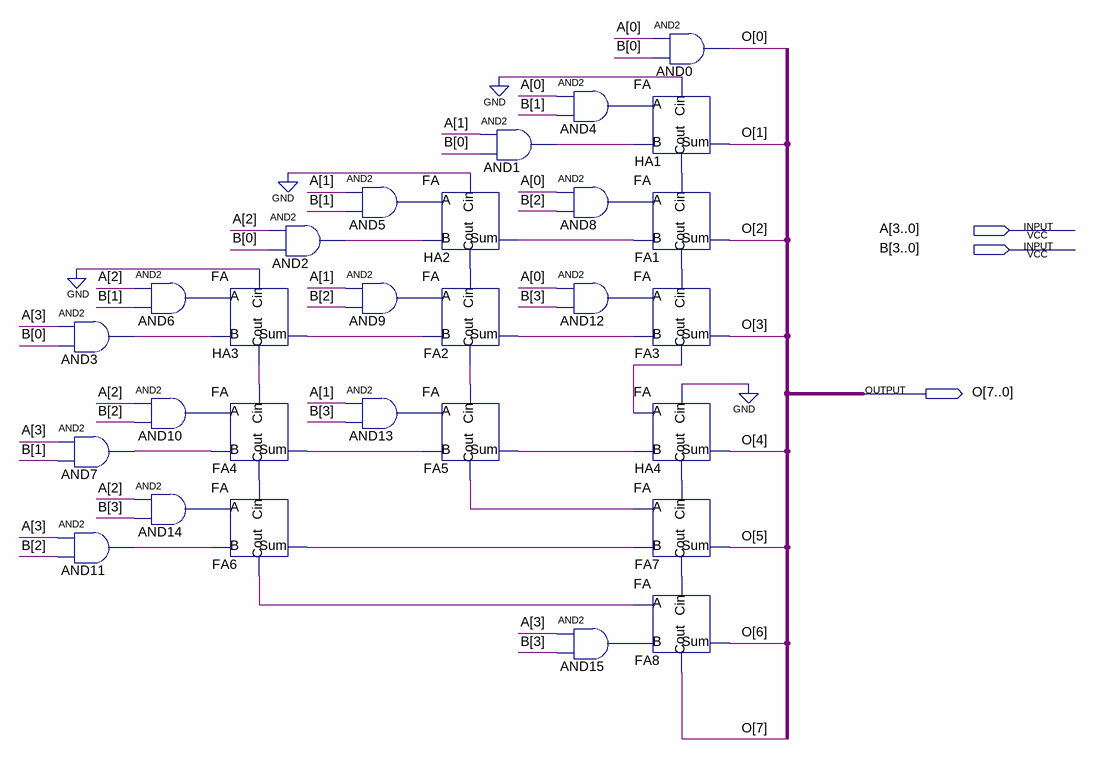
[diagram p0: schematic sheet]
// Quartus schematic Mult4.bdf as structural Verilog: 28 symbols, 3 pins
module Mult4 (
  input  [3:0] A,
  input  [3:0] B,
  output [7:0] O
);

  wire AND1_out, AND2_out, AND3_out, AND4_out, AND5_out, AND6_out, AND7_out, AND8_out, AND9_out, AND10_out,
       AND11_out, AND12_out, AND13_out, AND14_out, AND15_out, FA1_cout, FA2_cout, FA2_sum, FA3_cout,
       FA4_cout, FA4_sum, FA5_cout, FA5_sum, FA6_cout, FA6_sum, FA7_cout, HA1_cout, HA2_cout, HA2_sum,
       HA3_cout, HA3_sum, HA4_cout;

  and AND3 (AND3_out, A[3], B[0]);
  and AND7 (AND7_out, A[3], B[1]);
  and AND11 (AND11_out, A[3], B[2]);
  and AND6 (AND6_out, A[2], B[1]);
  and AND10 (AND10_out, A[2], B[2]);
  and AND14 (AND14_out, A[2], B[3]);
  FA HA3 (.A(AND6_out), .B(AND3_out), .Cin(1'b0), .Sum(HA3_sum), .Cout(HA3_cout));
  FA FA4 (.A(AND10_out), .B(AND7_out), .Cin(HA3_cout), .Sum(FA4_sum), .Cout(FA4_cout));
  FA FA6 (.A(AND14_out), .B(AND11_out), .Cin(FA4_cout), .Sum(FA6_sum), .Cout(FA6_cout));
  and AND2 (AND2_out, A[2], B[0]);
  and AND5 (AND5_out, A[1], B[1]);
  and AND9 (AND9_out, A[1], B[2]);
  and AND13 (AND13_out, A[1], B[3]);
  and AND1 (AND1_out, A[1], B[0]);
  FA HA2 (.A(AND5_out), .B(AND2_out), .Cin(1'b0), .Sum(HA2_sum), .Cout(HA2_cout));
  FA FA2 (.A(AND9_out), .B(HA3_sum), .Cin(HA2_cout), .Sum(FA2_sum), .Cout(FA2_cout));
  FA FA5 (.A(AND13_out), .B(FA4_sum), .Cin(FA2_cout), .Sum(FA5_sum), .Cout(FA5_cout));
  and AND4 (AND4_out, A[0], B[1]);
  and AND8 (AND8_out, A[0], B[2]);
  and AND12 (AND12_out, A[0], B[3]);
  and AND15 (AND15_out, A[3], B[3]);
  FA HA1 (.A(AND4_out), .B(AND1_out), .Cin(1'b0), .Sum(O[1]), .Cout(HA1_cout));
  FA FA1 (.A(AND8_out), .B(HA2_sum), .Cin(HA1_cout), .Sum(O[2]), .Cout(FA1_cout));
  FA FA3 (.A(AND12_out), .B(FA2_sum), .Cin(FA1_cout), .Sum(O[3]), .Cout(FA3_cout));
  FA HA4 (.A(FA3_cout), .B(FA5_sum), .Cin(1'b0), .Sum(O[4]), .Cout(HA4_cout));
  FA FA7 (.A(FA5_cout), .B(FA6_sum), .Cin(HA4_cout), .Sum(O[5]), .Cout(FA7_cout));
  FA FA8 (.A(FA6_cout), .B(AND15_out), .Cin(FA7_cout), .Sum(O[6]), .Cout(O[7]));
  and AND0 (O[0], A[0], B[0]);
endmodule
